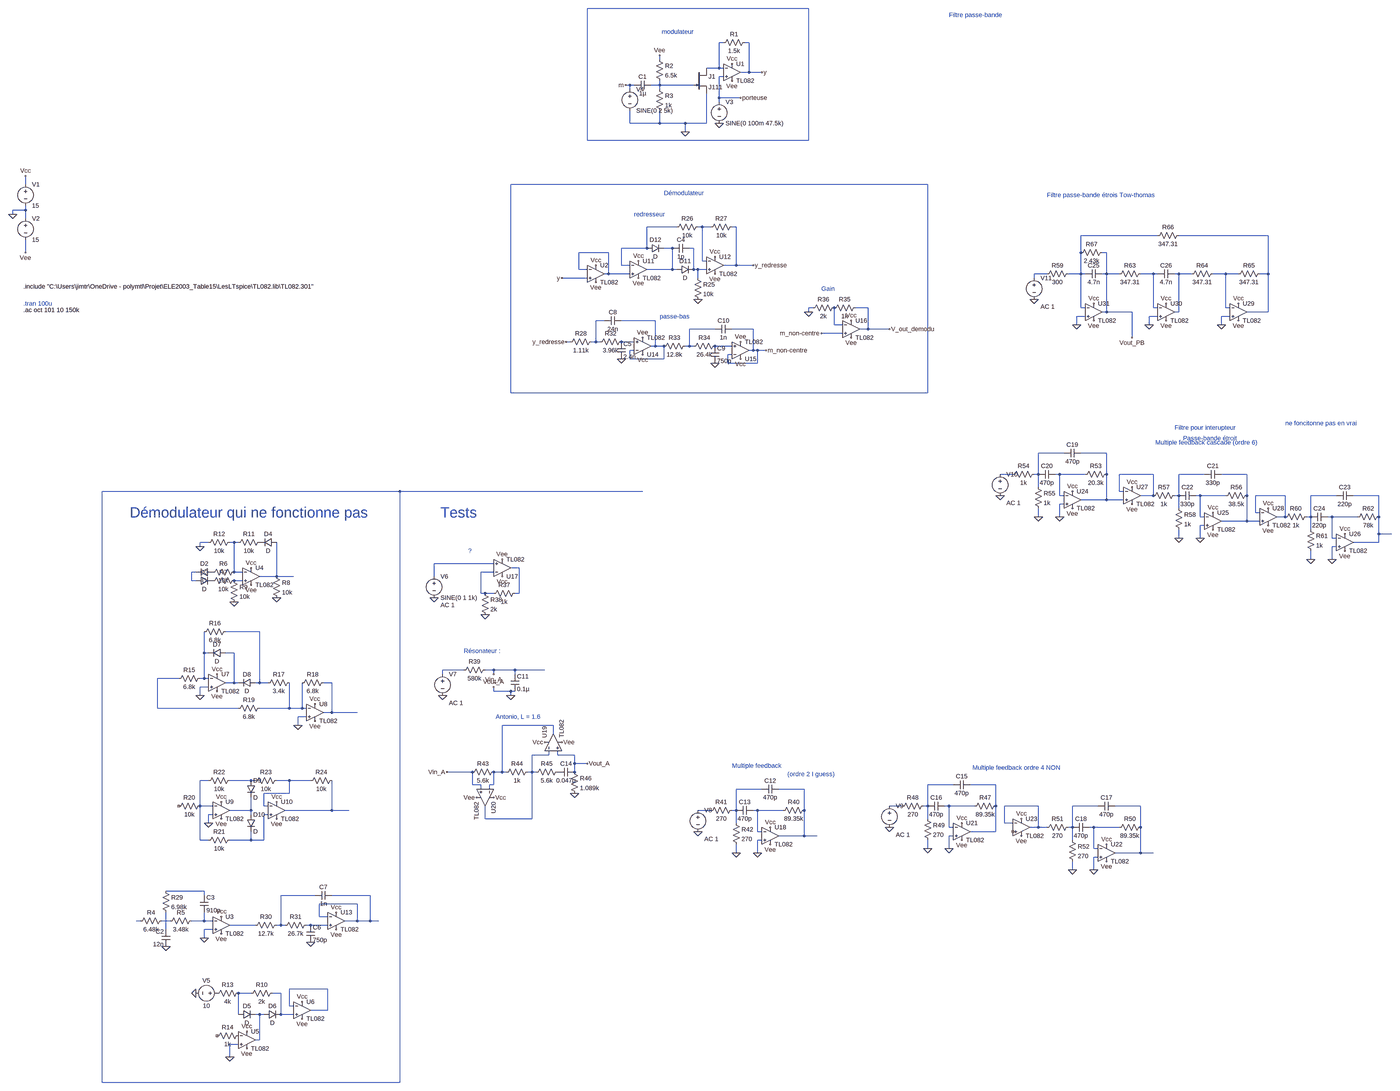
[diagram p0: schematic MonCircuit.asc, whole sheet]
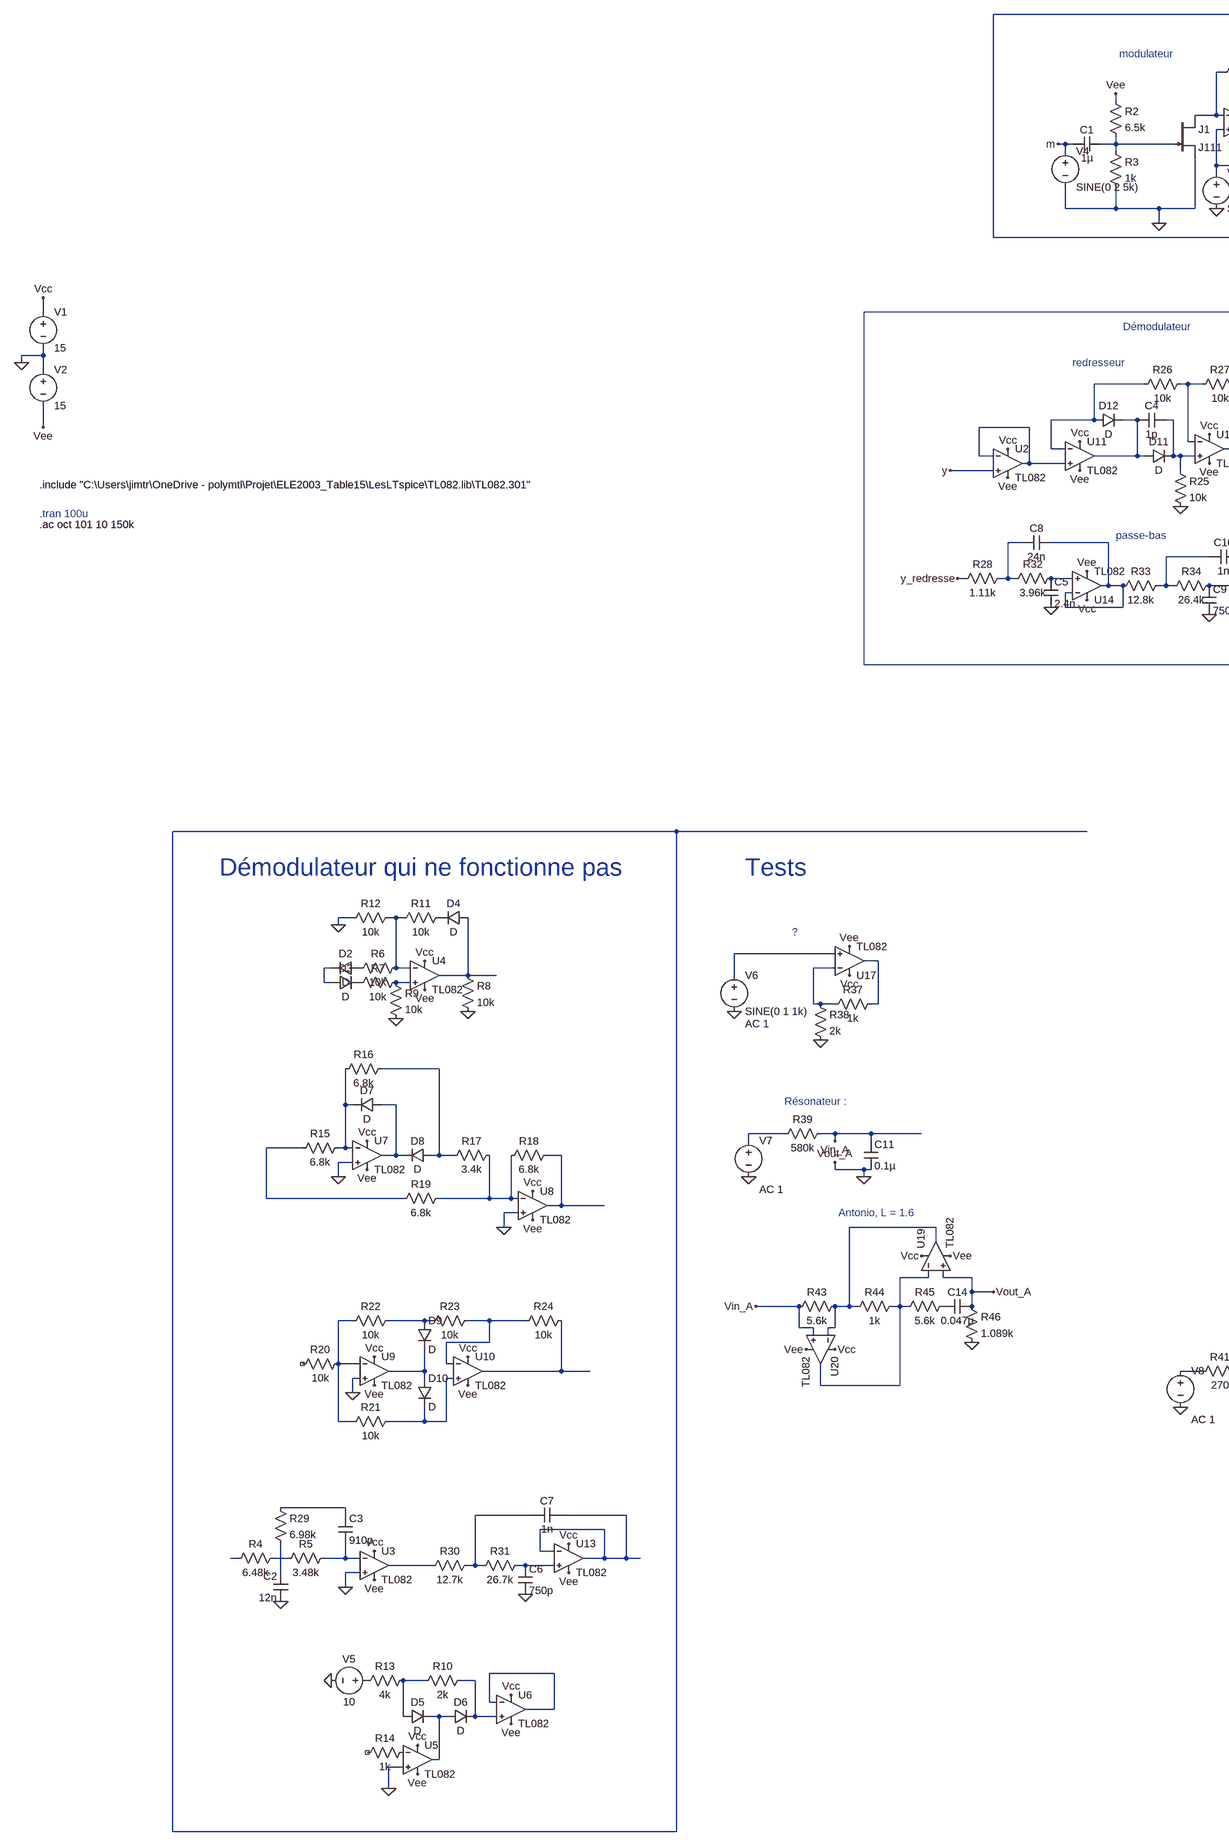
[diagram p1: schematic MonCircuit.asc, part, row 1 of 1, column 1 of 2]
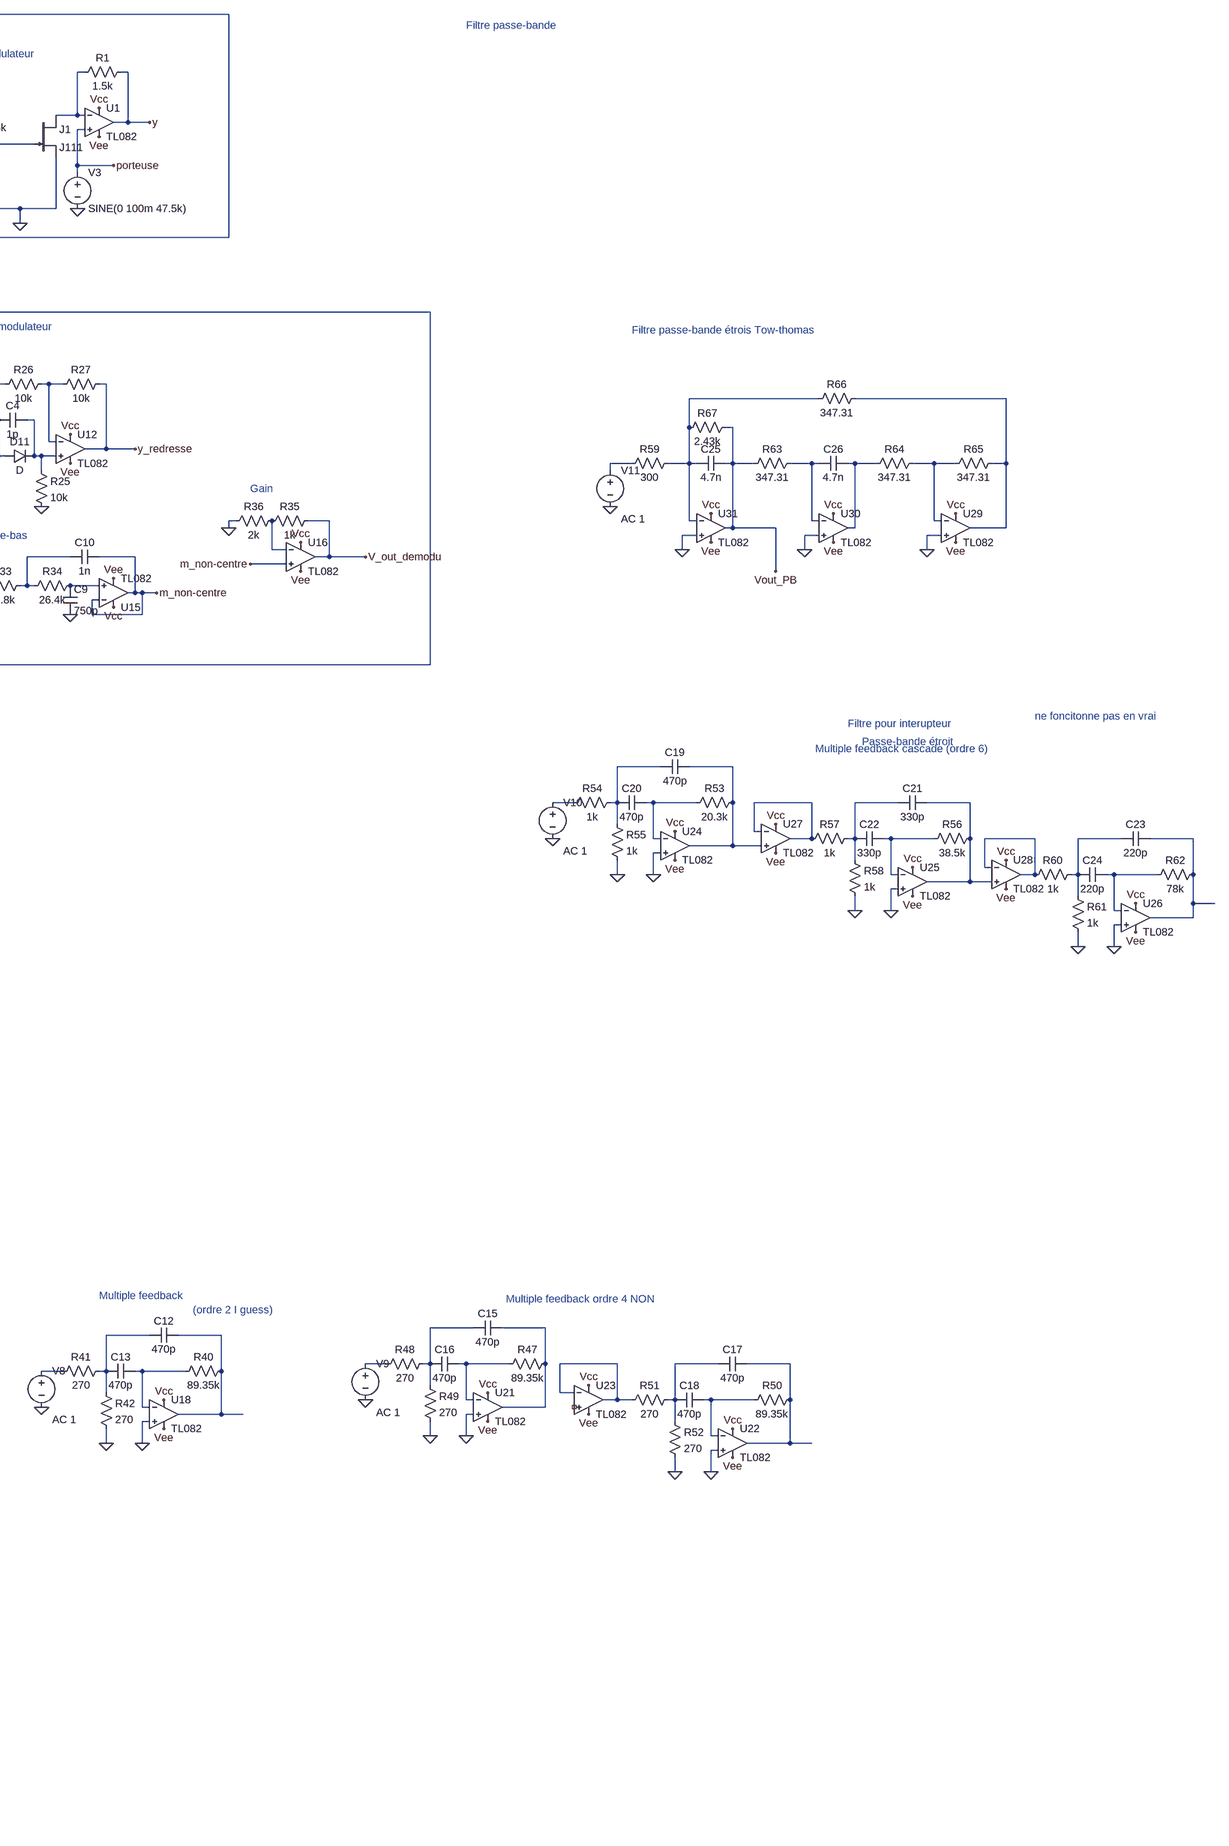
[diagram p2: schematic MonCircuit.asc, part, row 1 of 1, column 2 of 2]
MonCircuit.asc, the LTspice schematic file:
Version 4.1
SHEET 1 3508 3400
WIRE 1248 -880 416 -880
WIRE 928 -752 912 -752
WIRE 1024 -752 1008 -752
WIRE 688 -688 688 -704
WIRE 912 -656 912 -752
WIRE 912 -656 864 -656
WIRE 928 -656 912 -656
WIRE 1024 -640 1024 -752
WIRE 1024 -640 992 -640
WIRE 1072 -640 1024 -640
WIRE 928 -624 912 -624
WIRE 576 -592 560 -592
WIRE 592 -592 576 -592
WIRE 688 -592 688 -608
WIRE 688 -592 656 -592
WIRE 816 -592 688 -592
WIRE 576 -576 576 -592
WIRE 688 -576 688 -592
WIRE 912 -544 912 -624
WIRE 992 -544 912 -544
WIRE 912 -528 912 -544
WIRE 576 -448 576 -496
WIRE 688 -448 688 -496
WIRE 688 -448 576 -448
WIRE 784 -448 688 -448
WIRE 864 -448 864 -560
WIRE 864 -448 784 -448
WIRE 784 -416 784 -448
WIRE 416 -384 416 -880
WIRE 1248 -384 1248 -880
WIRE 1248 -384 416 -384
WIRE -1696 -208 -1696 -240
WIRE 1696 -208 128 -208
WIRE -1696 -112 -1696 -128
WIRE -1696 -112 -1744 -112
WIRE -1744 -96 -1744 -112
WIRE -1696 -80 -1696 -112
WIRE 752 -48 640 -48
WIRE 848 -48 832 -48
WIRE 880 -48 848 -48
WIRE 976 -48 960 -48
WIRE 2560 -16 2272 -16
WIRE 2976 -16 2640 -16
WIRE 640 32 640 -48
WIRE 640 32 544 32
WIRE 736 32 704 32
WIRE 816 32 800 32
WIRE -1696 48 -1696 0
WIRE 496 48 384 48
WIRE 2272 48 2272 -16
WIRE 2368 48 2352 48
WIRE 848 80 848 -48
WIRE 864 80 848 80
WIRE 544 96 544 32
WIRE 576 96 544 96
WIRE 976 96 976 -48
WIRE 976 96 928 96
WIRE 1040 96 976 96
WIRE 384 112 384 48
WIRE 416 112 384 112
WIRE 736 112 736 32
WIRE 736 112 640 112
WIRE 752 112 736 112
WIRE 816 112 816 32
WIRE 832 112 816 112
WIRE 864 112 832 112
WIRE 496 128 496 48
WIRE 496 128 480 128
WIRE 576 128 496 128
WIRE 2144 128 2096 128
WIRE 2272 128 2272 48
WIRE 2272 128 2224 128
WIRE 2288 128 2272 128
WIRE 2368 128 2368 48
WIRE 2368 128 2352 128
WIRE 2416 128 2368 128
WIRE 2544 128 2496 128
WIRE 2560 128 2544 128
WIRE 2640 128 2624 128
WIRE 2688 128 2640 128
WIRE 2816 128 2768 128
WIRE 2864 128 2816 128
WIRE 2976 128 2976 -16
WIRE 2976 128 2944 128
WIRE 416 144 320 144
WIRE 832 144 832 112
WIRE 2096 144 2096 128
WIRE 1264 256 1248 256
WIRE 1472 256 1424 256
WIRE 2272 256 2272 128
WIRE 2288 256 2272 256
WIRE 2544 256 2544 128
WIRE 2560 256 2544 256
WIRE 2816 256 2816 128
WIRE 2832 256 2816 256
WIRE 1248 272 1248 256
WIRE 2368 272 2368 128
WIRE 2368 272 2352 272
WIRE 2464 272 2368 272
WIRE 2640 272 2640 128
WIRE 2640 272 2624 272
WIRE 2976 272 2976 128
WIRE 2976 272 2896 272
WIRE 2288 288 2256 288
WIRE 2560 288 2528 288
WIRE 2832 288 2800 288
WIRE 480 304 448 304
WIRE 672 304 544 304
WIRE 1344 320 1344 256
WIRE 1376 320 1344 320
WIRE 2256 320 2256 288
WIRE 2528 320 2528 288
WIRE 2800 320 2800 288
WIRE 896 336 800 336
WIRE 1040 336 960 336
WIRE 1472 336 1472 256
WIRE 1472 336 1440 336
WIRE 1552 336 1472 336
WIRE 1376 352 1296 352
WIRE 2464 368 2464 272
WIRE 352 384 336 384
WIRE 448 384 448 304
WIRE 448 384 432 384
WIRE 464 384 448 384
WIRE 592 384 544 384
WIRE 672 400 672 304
WIRE 672 400 656 400
WIRE 704 400 672 400
WIRE 800 400 800 336
WIRE 800 400 784 400
WIRE 816 400 800 400
WIRE 960 400 896 400
WIRE 592 416 576 416
WIRE 1040 416 1040 336
WIRE 1040 416 1024 416
WIRE 1056 416 1040 416
WIRE 1088 416 1056 416
WIRE 960 432 944 432
WIRE 576 448 576 416
WIRE 704 448 704 400
WIRE 704 448 576 448
WIRE 944 464 944 432
WIRE 1056 464 1056 416
WIRE 1056 464 944 464
WIRE 128 576 128 -208
WIRE 1696 576 1696 -208
WIRE 1696 576 128 576
WIRE 2208 1024 2112 1024
WIRE 2368 1024 2272 1024
WIRE 2016 1104 1968 1104
WIRE 2112 1104 2112 1024
WIRE 2112 1104 2096 1104
WIRE 2192 1104 2176 1104
WIRE 2288 1104 2192 1104
WIRE 2368 1104 2368 1024
WIRE 2544 1104 2416 1104
WIRE 2736 1104 2640 1104
WIRE 2896 1104 2800 1104
WIRE 2112 1152 2112 1104
WIRE -288 1168 -1408 1168
WIRE 624 1168 -288 1168
WIRE 2416 1168 2416 1104
WIRE 2432 1168 2416 1168
WIRE 2192 1184 2192 1104
WIRE 2208 1184 2192 1184
WIRE 2544 1184 2544 1104
WIRE 2544 1184 2496 1184
WIRE 2640 1184 2640 1104
WIRE 2640 1184 2624 1184
WIRE 2720 1184 2704 1184
WIRE 2816 1184 2720 1184
WIRE 2896 1184 2896 1104
WIRE 3040 1184 2928 1184
WIRE 3232 1184 3136 1184
WIRE 3392 1184 3296 1184
WIRE 2368 1200 2368 1104
WIRE 2368 1200 2272 1200
WIRE 2432 1200 2368 1200
WIRE 2208 1216 2192 1216
WIRE 2640 1232 2640 1184
WIRE 2928 1248 2928 1184
WIRE 2944 1248 2928 1248
WIRE 2112 1264 2112 1232
WIRE 2192 1264 2192 1216
WIRE 2720 1264 2720 1184
WIRE 2736 1264 2720 1264
WIRE 3040 1264 3040 1184
WIRE 3040 1264 3008 1264
WIRE 3136 1264 3136 1184
WIRE 3136 1264 3120 1264
WIRE 3216 1264 3200 1264
WIRE 3312 1264 3216 1264
WIRE 3392 1264 3392 1184
WIRE 2896 1280 2896 1184
WIRE 2896 1280 2800 1280
WIRE 2944 1280 2896 1280
WIRE 2736 1296 2720 1296
WIRE 3136 1312 3136 1264
WIRE 3392 1328 3392 1264
WIRE 3440 1328 3392 1328
WIRE 2640 1344 2640 1312
WIRE 2720 1344 2720 1296
WIRE 3216 1344 3216 1264
WIRE 3232 1344 3216 1344
WIRE -1008 1360 -1040 1360
WIRE -912 1360 -928 1360
WIRE -896 1360 -912 1360
WIRE 3392 1360 3392 1328
WIRE 3392 1360 3296 1360
WIRE -1040 1376 -1040 1360
WIRE 3232 1376 3216 1376
WIRE 3136 1424 3136 1392
WIRE 3216 1424 3216 1376
WIRE 64 1440 -160 1440
WIRE 160 1456 128 1456
WIRE -1056 1472 -1072 1472
WIRE -912 1472 -912 1360
WIRE -880 1472 -912 1472
WIRE 64 1472 16 1472
WIRE -752 1488 -752 1360
WIRE -752 1488 -816 1488
WIRE -688 1488 -752 1488
WIRE -160 1488 -160 1440
WIRE -1072 1504 -1072 1472
WIRE -1056 1504 -1072 1504
WIRE -880 1504 -912 1504
WIRE 16 1552 16 1472
WIRE 32 1552 16 1552
WIRE 64 1552 32 1552
WIRE 160 1552 160 1456
WIRE 160 1552 144 1552
WIRE -816 1696 -944 1696
WIRE -1024 1776 -1024 1696
WIRE -1008 1776 -1024 1776
WIRE -912 1776 -944 1776
WIRE -48 1840 -128 1840
WIRE 64 1840 32 1840
WIRE 144 1840 64 1840
WIRE 256 1840 144 1840
WIRE -128 1856 -128 1840
WIRE 64 1856 64 1840
WIRE 144 1856 144 1840
WIRE -1120 1872 -1200 1872
WIRE -1024 1872 -1024 1776
WIRE -1024 1872 -1040 1872
WIRE -1008 1872 -1024 1872
WIRE -912 1888 -912 1776
WIRE -912 1888 -944 1888
WIRE -896 1888 -912 1888
WIRE -816 1888 -816 1696
WIRE -816 1888 -832 1888
WIRE -784 1888 -816 1888
WIRE -544 1888 -576 1888
WIRE -1008 1904 -1040 1904
WIRE 64 1920 64 1904
WIRE 128 1920 64 1920
WIRE 144 1920 128 1920
WIRE -1040 1936 -1040 1904
WIRE 128 1936 128 1920
WIRE -1200 1984 -1200 1872
WIRE -896 1984 -1200 1984
WIRE -704 1984 -704 1888
WIRE -704 1984 -816 1984
WIRE -656 1984 -656 1888
WIRE -656 1984 -704 1984
WIRE -640 1984 -656 1984
WIRE -544 2000 -544 1888
WIRE -544 2000 -576 2000
WIRE -448 2000 -544 2000
WIRE -640 2016 -672 2016
WIRE -672 2048 -672 2016
WIRE 288 2048 96 2048
WIRE 288 2080 288 2048
WIRE 272 2160 272 2144
WIRE 272 2160 208 2160
WIRE 304 2160 304 2144
WIRE 368 2160 304 2160
WIRE 368 2192 368 2160
WIRE 416 2192 368 2192
WIRE -16 2224 -112 2224
WIRE 96 2224 96 2048
WIRE 96 2224 64 2224
WIRE 112 2224 96 2224
WIRE 208 2224 208 2160
WIRE 208 2224 192 2224
WIRE 224 2224 208 2224
WIRE 368 2224 368 2192
WIRE -1008 2256 -1040 2256
WIRE -848 2256 -928 2256
WIRE -832 2256 -848 2256
WIRE -704 2256 -752 2256
WIRE -624 2256 -704 2256
WIRE -16 2272 -16 2224
WIRE 16 2272 -16 2272
WIRE 64 2272 64 2224
WIRE 64 2272 48 2272
WIRE 1792 2272 1696 2272
WIRE 1952 2272 1856 2272
WIRE 16 2288 16 2272
WIRE 48 2288 48 2272
WIRE 1072 2288 976 2288
WIRE 1232 2288 1136 2288
WIRE -704 2304 -704 2256
WIRE -704 2304 -800 2304
WIRE -1040 2352 -1040 2256
WIRE -992 2352 -1040 2352
WIRE -800 2352 -800 2304
WIRE -784 2352 -800 2352
WIRE 1600 2352 1552 2352
WIRE 1696 2352 1696 2272
WIRE 1696 2352 1680 2352
WIRE 1776 2352 1760 2352
WIRE 1872 2352 1776 2352
WIRE 1952 2352 1952 2272
WIRE 2112 2352 1984 2352
WIRE 2336 2352 2240 2352
WIRE 2496 2352 2400 2352
WIRE -848 2368 -848 2320
WIRE -848 2368 -928 2368
WIRE -544 2368 -544 2256
WIRE -544 2368 -720 2368
WIRE -480 2368 -544 2368
WIRE 880 2368 832 2368
WIRE 976 2368 976 2288
WIRE 976 2368 960 2368
WIRE 1056 2368 1040 2368
WIRE 1152 2368 1056 2368
WIRE 1232 2368 1232 2288
WIRE -992 2384 -1008 2384
WIRE -848 2384 -848 2368
WIRE -784 2384 -800 2384
WIRE 32 2400 32 2352
WIRE 208 2400 208 2224
WIRE 208 2400 32 2400
WIRE 1696 2400 1696 2352
WIRE -1008 2416 -1008 2384
WIRE 976 2416 976 2368
WIRE 1984 2416 1984 2352
WIRE 2016 2416 1984 2416
WIRE 1776 2432 1776 2352
WIRE 1792 2432 1776 2432
WIRE 2112 2432 2112 2352
WIRE 2112 2432 2080 2432
WIRE 2144 2432 2112 2432
WIRE 2240 2432 2240 2352
WIRE 2240 2432 2224 2432
WIRE 2320 2432 2304 2432
WIRE 2416 2432 2320 2432
WIRE 2496 2432 2496 2352
WIRE 1056 2448 1056 2368
WIRE 1072 2448 1056 2448
WIRE 1952 2448 1952 2352
WIRE 1952 2448 1856 2448
WIRE 1232 2464 1232 2368
WIRE 1232 2464 1136 2464
WIRE 1280 2464 1232 2464
WIRE 1792 2464 1776 2464
WIRE -1040 2480 -1040 2352
WIRE -1008 2480 -1040 2480
WIRE -848 2480 -848 2448
WIRE -848 2480 -928 2480
WIRE -800 2480 -800 2384
WIRE -800 2480 -848 2480
WIRE 1072 2480 1056 2480
WIRE 2240 2480 2240 2432
WIRE 1696 2512 1696 2480
WIRE 1776 2512 1776 2464
WIRE 2320 2512 2320 2432
WIRE 2336 2512 2320 2512
WIRE 976 2528 976 2496
WIRE 1056 2528 1056 2480
WIRE 2496 2528 2496 2432
WIRE 2496 2528 2400 2528
WIRE 2544 2528 2496 2528
WIRE 2336 2544 2320 2544
WIRE 2240 2592 2240 2560
WIRE 2320 2592 2320 2544
WIRE -1024 2672 -1168 2672
WIRE -1024 2688 -1024 2672
WIRE -608 2688 -736 2688
WIRE -400 2688 -544 2688
WIRE -448 2720 -592 2720
WIRE -592 2768 -592 2720
WIRE -560 2768 -592 2768
WIRE -1264 2784 -1280 2784
WIRE -1152 2784 -1184 2784
WIRE -1024 2784 -1024 2752
WIRE -1024 2784 -1072 2784
WIRE -992 2784 -1024 2784
WIRE -448 2784 -448 2720
WIRE -448 2784 -496 2784
WIRE -400 2784 -400 2688
WIRE -400 2784 -448 2784
WIRE -368 2784 -400 2784
WIRE -832 2800 -928 2800
WIRE -736 2800 -736 2688
WIRE -736 2800 -752 2800
WIRE -720 2800 -736 2800
WIRE -624 2800 -640 2800
WIRE -560 2800 -624 2800
WIRE -1168 2816 -1168 2752
WIRE -992 2816 -1024 2816
WIRE -1024 2848 -1024 2816
WIRE -560 3040 -704 3040
WIRE -848 3056 -896 3056
WIRE -736 3056 -768 3056
WIRE -704 3104 -704 3040
WIRE -688 3104 -704 3104
WIRE -560 3120 -560 3040
WIRE -560 3120 -624 3120
WIRE -896 3136 -896 3056
WIRE -816 3136 -832 3136
WIRE -800 3136 -816 3136
WIRE -736 3136 -736 3056
WIRE -688 3136 -736 3136
WIRE -816 3232 -816 3136
WIRE -816 3232 -832 3232
WIRE -896 3248 -928 3248
WIRE -928 3296 -928 3248
WIRE -1408 3392 -1408 1168
WIRE -288 3392 -288 1168
WIRE -288 3392 -1408 3392
FLAG -1744 -96 0
FLAG -1696 48 Vee
FLAG -1696 -240 Vcc
FLAG 960 -608 Vee
FLAG 960 -672 Vcc
FLAG 1072 -640 y
FLAG 912 -448 0
FLAG 992 -544 porteuse
FLAG 784 -416 0
FLAG 688 -704 Vee
FLAG 560 -592 m
FLAG 448 160 Vee
FLAG 448 96 Vcc
FLAG 320 144 y
FLAG -848 1520 Vee
FLAG -848 1456 Vcc
FLAG -752 1568 0
FLAG -1040 1376 0
FLAG -912 1584 0
FLAG -864 3200 Vcc
FLAG -864 3264 Vee
FLAG -928 3296 0
FLAG -1056 3056 0
FLAG -656 3088 Vcc
FLAG -656 3152 Vee
FLAG -976 1920 Vee
FLAG -976 1856 Vcc
FLAG -1040 1936 0
FLAG -672 2048 0
FLAG -608 2032 Vee
FLAG -608 1968 Vcc
FLAG -960 2336 Vcc
FLAG -752 2336 Vcc
FLAG -960 2400 Vee
FLAG -752 2400 Vee
FLAG -1008 2416 0
FLAG 608 144 Vee
FLAG 608 80 Vcc
FLAG 896 128 Vee
FLAG 896 64 Vcc
FLAG 832 224 0
FLAG 1040 96 y_redresse
FLAG -960 2832 Vee
FLAG -960 2768 Vcc
FLAG -1024 2848 0
FLAG -1168 2880 0
FLAG -624 2864 0
FLAG -528 2816 Vee
FLAG -528 2752 Vcc
FLAG 544 448 0
FLAG 624 368 Vee
FLAG 624 432 Vcc
FLAG 896 464 0
FLAG 992 384 Vee
FLAG 992 448 Vcc
FLAG 336 384 y_redresse
FLAG 1088 416 m_non-centre
FLAG 1296 352 m_non-centre
FLAG 1408 304 Vcc
FLAG 1408 368 Vee
FLAG 1248 272 0
FLAG 96 1488 Vcc
FLAG 96 1424 Vee
FLAG -160 1568 0
FLAG 32 1632 0
FLAG -128 1936 0
FLAG 128 1936 0
FLAG 1552 336 V_out_demodu
FLAG 1104 2432 Vcc
FLAG 1104 2496 Vee
FLAG 1056 2528 0
FLAG 832 2448 0
FLAG 976 2528 0
FLAG 256 2112 Vcc
FLAG 64 2320 Vcc
FLAG 0 2320 Vee
FLAG 320 2112 Vee
FLAG 368 2304 0
FLAG -112 2224 Vin_A
FLAG 416 2192 Vout_A
FLAG 64 1856 Vin_A
FLAG 64 1904 Vout_A
FLAG 1824 2416 Vcc
FLAG 1824 2480 Vee
FLAG 1776 2512 0
FLAG 1552 2432 0
FLAG 1696 2512 0
FLAG 2368 2496 Vcc
FLAG 2368 2560 Vee
FLAG 2320 2592 0
FLAG 2240 2592 0
FLAG 2048 2400 Vcc
FLAG 2048 2464 Vee
FLAG 2240 1168 Vcc
FLAG 2240 1232 Vee
FLAG 2192 1264 0
FLAG 1968 1184 0
FLAG 2112 1264 0
FLAG 2768 1248 Vcc
FLAG 2768 1312 Vee
FLAG 2720 1344 0
FLAG 2640 1344 0
FLAG 3264 1328 Vcc
FLAG 3264 1392 Vee
FLAG 3216 1424 0
FLAG 3136 1424 0
FLAG 2464 1216 Vee
FLAG 2464 1152 Vcc
FLAG 2976 1296 Vee
FLAG 2976 1232 Vcc
FLAG 2320 240 Vcc
FLAG 2592 240 Vcc
FLAG 2864 240 Vcc
FLAG 2320 304 Vee
FLAG 2592 304 Vee
FLAG 2864 304 Vee
FLAG 2256 320 0
FLAG 2528 320 0
FLAG 2800 320 0
FLAG 2096 224 0
FLAG 2464 368 Vout_PB
SYMBOL voltage -1696 -224 R0
WINDOW 123 0 0 Left 0
WINDOW 39 0 0 Left 0
SYMATTR InstName V1
SYMATTR Value 15
SYMBOL voltage -1696 -96 R0
WINDOW 123 0 0 Left 0
WINDOW 39 0 0 Left 0
SYMATTR InstName V2
SYMATTR Value 15
SYMBOL OpAmps\\opamp2 960 -704 R0
SYMATTR InstName U1
SYMATTR Value TL082
SYMBOL res 1024 -768 R90
WINDOW 0 0 56 VBottom 2
WINDOW 3 32 56 VTop 2
SYMATTR InstName R1
SYMATTR Value 1.5k
SYMBOL res 672 -704 R0
SYMATTR InstName R2
SYMATTR Value 6.5k
SYMBOL res 672 -592 R0
SYMATTR InstName R3
SYMATTR Value 1k
SYMBOL njf 816 -656 R0
SYMATTR InstName J1
SYMATTR Value J111
SYMBOL voltage 912 -544 R0
WINDOW 123 0 0 Left 0
WINDOW 39 0 0 Left 0
SYMATTR InstName V3
SYMATTR Value SINE(0 100m 47.5k)
SYMBOL cap 656 -608 R90
WINDOW 0 0 32 VBottom 2
WINDOW 3 32 32 VTop 2
SYMATTR InstName C1
SYMATTR Value 1µ
SYMBOL voltage 576 -592 R0
WINDOW 123 0 0 Left 0
WINDOW 39 0 0 Left 0
SYMATTR InstName V4
SYMATTR Value SINE(0 2 5k)
SYMBOL OpAmps\\opamp2 448 64 R0
SYMATTR InstName U2
SYMATTR Value TL082
SYMBOL OpAmps\\opamp2 -848 1424 R0
SYMATTR InstName U4
SYMATTR Value TL082
SYMBOL diode -992 1456 R90
WINDOW 0 0 32 VBottom 2
WINDOW 3 32 32 VTop 2
SYMATTR InstName D2
SYMBOL diode -1056 1520 R270
WINDOW 0 32 32 VTop 2
WINDOW 3 0 32 VBottom 2
SYMATTR InstName D3
SYMBOL res -768 1472 R0
SYMATTR InstName R8
SYMATTR Value 10k
SYMBOL res -928 1488 R0
SYMATTR InstName R9
SYMATTR Value 10k
SYMBOL res -912 1344 R90
WINDOW 0 0 56 VBottom 2
WINDOW 3 32 56 VTop 2
SYMATTR InstName R12
SYMATTR Value 10k
SYMBOL res -800 1344 R90
WINDOW 0 0 56 VBottom 2
WINDOW 3 32 56 VTop 2
SYMATTR InstName R11
SYMATTR Value 10k
SYMBOL diode -752 1344 R90
WINDOW 0 0 32 VBottom 2
WINDOW 3 32 32 VTop 2
SYMATTR InstName D4
SYMBOL res -896 1456 R90
WINDOW 0 0 56 VBottom 2
WINDOW 3 32 56 VTop 2
SYMATTR InstName R6
SYMATTR Value 10k
SYMBOL res -896 1488 R90
WINDOW 0 0 56 VBottom 2
WINDOW 3 32 56 VTop 2
SYMATTR InstName R7
SYMATTR Value 10k
SYMBOL OpAmps\\opamp2 -864 3168 R0
SYMATTR InstName U5
SYMATTR Value TL082
SYMBOL diode -896 3152 R270
WINDOW 0 32 32 VTop 2
WINDOW 3 0 32 VBottom 2
SYMATTR InstName D5
SYMBOL diode -800 3152 R270
WINDOW 0 32 32 VTop 2
WINDOW 3 0 32 VBottom 2
SYMATTR InstName D6
SYMBOL res -752 3040 R90
WINDOW 0 0 56 VBottom 2
WINDOW 3 32 56 VTop 2
SYMATTR InstName R10
SYMATTR Value 2k
SYMBOL res -880 3040 R90
WINDOW 0 0 56 VBottom 2
WINDOW 3 32 56 VTop 2
SYMATTR InstName R13
SYMATTR Value 4k
SYMBOL res -880 3200 R90
WINDOW 0 0 56 VBottom 2
WINDOW 3 32 56 VTop 2
SYMATTR InstName R14
SYMATTR Value 1k
SYMBOL voltage -960 3056 R90
WINDOW 0 -32 56 VBottom 2
WINDOW 3 32 56 VTop 2
WINDOW 123 0 0 Left 0
WINDOW 39 0 0 Left 0
SYMATTR InstName V5
SYMATTR Value 10
SYMBOL OpAmps\\opamp2 -656 3056 R0
SYMATTR InstName U6
SYMATTR Value TL082
SYMBOL res -1024 1856 R90
WINDOW 0 0 56 VBottom 2
WINDOW 3 32 56 VTop 2
SYMATTR InstName R15
SYMATTR Value 6.8k
SYMBOL OpAmps\\opamp2 -976 1824 R0
SYMATTR InstName U7
SYMATTR Value TL082
SYMBOL diode -944 1760 R90
WINDOW 0 0 32 VBottom 2
WINDOW 3 32 32 VTop 2
SYMATTR InstName D7
SYMBOL res -928 1680 R90
WINDOW 0 0 56 VBottom 2
WINDOW 3 32 56 VTop 2
SYMATTR InstName R16
SYMATTR Value 6.8k
SYMBOL diode -832 1872 R90
WINDOW 0 0 32 VBottom 2
WINDOW 3 32 32 VTop 2
SYMATTR InstName D8
SYMBOL res -688 1872 R90
WINDOW 0 0 56 VBottom 2
WINDOW 3 32 56 VTop 2
SYMATTR InstName R17
SYMATTR Value 3.4k
SYMBOL OpAmps\\opamp2 -608 1936 R0
SYMATTR InstName U8
SYMATTR Value TL082
SYMBOL res -560 1872 R90
WINDOW 0 0 56 VBottom 2
WINDOW 3 32 56 VTop 2
SYMATTR InstName R18
SYMATTR Value 6.8k
SYMBOL res -800 1968 R90
WINDOW 0 0 56 VBottom 2
WINDOW 3 32 56 VTop 2
SYMATTR InstName R19
SYMATTR Value 6.8k
SYMBOL OpAmps\\opamp2 -960 2304 R0
SYMATTR InstName U9
SYMATTR Value TL082
SYMBOL OpAmps\\opamp2 -752 2304 R0
SYMATTR InstName U10
SYMATTR Value TL082
SYMBOL res -1024 2336 R90
WINDOW 0 0 56 VBottom 2
WINDOW 3 32 56 VTop 2
SYMATTR InstName R20
SYMATTR Value 10k
SYMBOL res -912 2464 R90
WINDOW 0 0 56 VBottom 2
WINDOW 3 32 56 VTop 2
SYMATTR InstName R21
SYMATTR Value 10k
SYMBOL res -912 2240 R90
WINDOW 0 0 56 VBottom 2
WINDOW 3 32 56 VTop 2
SYMATTR InstName R22
SYMATTR Value 10k
SYMBOL res -736 2240 R90
WINDOW 0 0 56 VBottom 2
WINDOW 3 32 56 VTop 2
SYMATTR InstName R23
SYMATTR Value 10k
SYMBOL res -528 2240 R90
WINDOW 0 0 56 VBottom 2
WINDOW 3 32 56 VTop 2
SYMATTR InstName R24
SYMATTR Value 10k
SYMBOL diode -864 2256 R0
SYMATTR InstName D9
SYMBOL diode -864 2384 R0
SYMATTR InstName D10
SYMBOL OpAmps\\opamp2 608 48 R0
SYMATTR InstName U11
SYMATTR Value TL082
SYMBOL diode 752 128 R270
WINDOW 0 32 32 VTop 2
WINDOW 3 0 32 VBottom 2
SYMATTR InstName D11
SYMBOL cap 800 16 R90
WINDOW 0 0 32 VBottom 2
WINDOW 3 32 32 VTop 2
SYMATTR InstName C4
SYMATTR Value 1p
SYMBOL diode 640 48 R270
WINDOW 0 32 32 VTop 2
WINDOW 3 0 32 VBottom 2
SYMATTR InstName D12
SYMBOL OpAmps\\opamp2 896 32 R0
SYMATTR InstName U12
SYMATTR Value TL082
SYMBOL res 816 128 R0
SYMATTR InstName R25
SYMATTR Value 10k
SYMBOL res 848 -64 R90
WINDOW 0 0 56 VBottom 2
WINDOW 3 32 56 VTop 2
SYMATTR InstName R26
SYMATTR Value 10k
SYMBOL res 976 -64 R90
WINDOW 0 0 56 VBottom 2
WINDOW 3 32 56 VTop 2
SYMATTR InstName R27
SYMATTR Value 10k
SYMBOL res -1168 2768 R90
WINDOW 0 0 56 VBottom 2
WINDOW 3 32 56 VTop 2
SYMATTR InstName R4
SYMATTR Value 6.48k
SYMBOL res -1056 2768 R90
WINDOW 0 0 56 VBottom 2
WINDOW 3 32 56 VTop 2
SYMATTR InstName R5
SYMATTR Value 3.48k
SYMBOL cap -1152 2880 R180
WINDOW 0 24 56 Left 2
WINDOW 3 24 8 Left 2
SYMATTR InstName C2
SYMATTR Value 12n
SYMBOL res -1184 2656 R0
SYMATTR InstName R29
SYMATTR Value 6.98k
SYMBOL cap -1040 2688 R0
SYMATTR InstName C3
SYMATTR Value 910p
SYMBOL OpAmps\\opamp2 -960 2736 R0
SYMATTR InstName U3
SYMATTR Value TL082
SYMBOL res -736 2784 R90
WINDOW 0 0 56 VBottom 2
WINDOW 3 32 56 VTop 2
SYMATTR InstName R30
SYMATTR Value 12.7k
SYMBOL res -624 2784 R90
WINDOW 0 0 56 VBottom 2
WINDOW 3 32 56 VTop 2
SYMATTR InstName R31
SYMATTR Value 26.7k
SYMBOL cap -640 2800 R0
SYMATTR InstName C6
SYMATTR Value 750p
SYMBOL OpAmps\\opamp2 -528 2720 R0
SYMATTR InstName U13
SYMATTR Value TL082
SYMBOL cap -544 2672 R90
WINDOW 0 0 32 VBottom 2
WINDOW 3 32 32 VTop 2
SYMATTR InstName C7
SYMATTR Value 1n
SYMBOL res 448 368 R90
WINDOW 0 0 56 VBottom 2
WINDOW 3 32 56 VTop 2
SYMATTR InstName R28
SYMATTR Value 1.11k
SYMBOL res 560 368 R90
WINDOW 0 0 56 VBottom 2
WINDOW 3 32 56 VTop 2
SYMATTR InstName R32
SYMATTR Value 3.96k
SYMBOL cap 528 384 R0
SYMATTR InstName C5
SYMATTR Value 2.4n
SYMBOL cap 544 288 R90
WINDOW 0 0 32 VBottom 2
WINDOW 3 32 32 VTop 2
SYMATTR InstName C8
SYMATTR Value 24n
SYMBOL OpAmps\\opamp2 624 464 M180
SYMATTR InstName U14
SYMATTR Value TL082
SYMBOL res 800 384 R90
WINDOW 0 0 56 VBottom 2
WINDOW 3 32 56 VTop 2
SYMATTR InstName R33
SYMATTR Value 12.8k
SYMBOL res 912 384 R90
WINDOW 0 0 56 VBottom 2
WINDOW 3 32 56 VTop 2
SYMATTR InstName R34
SYMATTR Value 26.4k
SYMBOL cap 880 400 R0
SYMATTR InstName C9
SYMATTR Value 750p
SYMBOL OpAmps\\opamp2 992 480 M180
SYMATTR InstName U15
SYMATTR Value TL082
SYMBOL cap 960 320 R90
WINDOW 0 0 32 VBottom 2
WINDOW 3 32 32 VTop 2
SYMATTR InstName C10
SYMATTR Value 1n
SYMBOL OpAmps\\opamp2 1408 272 R0
SYMATTR InstName U16
SYMATTR Value TL082
SYMBOL res 1440 240 R90
WINDOW 0 0 56 VBottom 2
WINDOW 3 32 56 VTop 2
SYMATTR InstName R35
SYMATTR Value 1k
SYMBOL res 1360 240 R90
WINDOW 0 0 56 VBottom 2
WINDOW 3 32 56 VTop 2
SYMATTR InstName R36
SYMATTR Value 2k
SYMBOL voltage -160 1472 R0
WINDOW 123 24 124 Left 2
WINDOW 39 0 0 Left 0
SYMATTR Value2 AC 1
SYMATTR InstName V6
SYMATTR Value SINE(0 1 1k)
SYMBOL OpAmps\\opamp2 96 1520 M180
SYMATTR InstName U17
SYMATTR Value TL082
SYMBOL res 160 1536 R90
WINDOW 0 0 56 VBottom 2
WINDOW 3 32 56 VTop 2
SYMATTR InstName R37
SYMATTR Value 1k
SYMBOL res 16 1536 R0
SYMATTR InstName R38
SYMATTR Value 2k
SYMBOL voltage -128 1840 R0
WINDOW 123 24 124 Left 2
WINDOW 39 0 0 Left 0
SYMATTR Value2 AC 1
SYMATTR InstName V7
SYMATTR Value ""
SYMBOL cap 128 1856 R0
SYMATTR InstName C11
SYMATTR Value 0.1µ
SYMBOL res 48 1824 R90
WINDOW 0 0 56 VBottom 2
WINDOW 3 32 56 VTop 2
SYMATTR InstName R39
SYMATTR Value 580k
SYMBOL OpAmps\\opamp2 1104 2400 R0
SYMATTR InstName U18
SYMATTR Value TL082
SYMBOL cap 1136 2272 R90
WINDOW 0 0 32 VBottom 2
WINDOW 3 32 32 VTop 2
SYMATTR InstName C12
SYMATTR Value 470p
SYMBOL cap 1040 2352 R90
WINDOW 0 0 32 VBottom 2
WINDOW 3 32 32 VTop 2
SYMATTR InstName C13
SYMATTR Value 470p
SYMBOL res 1248 2352 R90
WINDOW 0 0 56 VBottom 2
WINDOW 3 32 56 VTop 2
SYMATTR InstName R40
SYMATTR Value 89.35k
SYMBOL res 864 2384 R270
WINDOW 0 32 56 VTop 2
WINDOW 3 0 56 VBottom 2
SYMATTR InstName R41
SYMATTR Value 270
SYMBOL res 960 2400 R0
SYMATTR InstName R42
SYMATTR Value 270
SYMBOL voltage 832 2352 R0
WINDOW 123 24 124 Left 2
WINDOW 39 0 0 Left 0
SYMATTR Value2 AC 1
SYMATTR InstName V8
SYMATTR Value ""
SYMBOL OpAmps\\opamp2 224 2112 R270
SYMATTR InstName U19
SYMATTR Value TL082
SYMBOL OpAmps\\opamp2 96 2320 R90
SYMATTR InstName U20
SYMATTR Value TL082
SYMBOL res 80 2208 R90
WINDOW 0 0 56 VBottom 2
WINDOW 3 32 56 VTop 2
SYMATTR InstName R43
SYMATTR Value 5.6k
SYMBOL res 208 2208 R90
WINDOW 0 0 56 VBottom 2
WINDOW 3 32 56 VTop 2
SYMATTR InstName R44
SYMATTR Value 1k
SYMBOL res 320 2208 R90
WINDOW 0 0 56 VBottom 2
WINDOW 3 32 56 VTop 2
SYMATTR InstName R45
SYMATTR Value 5.6k
SYMBOL cap 368 2208 R90
WINDOW 0 0 32 VBottom 2
WINDOW 3 32 32 VTop 2
SYMATTR InstName C14
SYMATTR Value 0.047µ
SYMBOL res 352 2208 R0
SYMATTR InstName R46
SYMATTR Value 1.089k
SYMBOL OpAmps\\opamp2 1824 2384 R0
SYMATTR InstName U21
SYMATTR Value TL082
SYMBOL cap 1856 2256 R90
WINDOW 0 0 32 VBottom 2
WINDOW 3 32 32 VTop 2
SYMATTR InstName C15
SYMATTR Value 470p
SYMBOL cap 1760 2336 R90
WINDOW 0 0 32 VBottom 2
WINDOW 3 32 32 VTop 2
SYMATTR InstName C16
SYMATTR Value 470p
SYMBOL res 1968 2336 R90
WINDOW 0 0 56 VBottom 2
WINDOW 3 32 56 VTop 2
SYMATTR InstName R47
SYMATTR Value 89.35k
SYMBOL res 1584 2368 R270
WINDOW 0 32 56 VTop 2
WINDOW 3 0 56 VBottom 2
SYMATTR InstName R48
SYMATTR Value 270
SYMBOL res 1680 2384 R0
SYMATTR InstName R49
SYMATTR Value 270
SYMBOL voltage 1552 2336 R0
WINDOW 123 24 124 Left 2
WINDOW 39 0 0 Left 0
SYMATTR Value2 AC 1
SYMATTR InstName V9
SYMATTR Value ""
SYMBOL OpAmps\\opamp2 2368 2464 R0
SYMATTR InstName U22
SYMATTR Value TL082
SYMBOL cap 2400 2336 R90
WINDOW 0 0 32 VBottom 2
WINDOW 3 32 32 VTop 2
SYMATTR InstName C17
SYMATTR Value 470p
SYMBOL cap 2304 2416 R90
WINDOW 0 0 32 VBottom 2
WINDOW 3 32 32 VTop 2
SYMATTR InstName C18
SYMATTR Value 470p
SYMBOL res 2512 2416 R90
WINDOW 0 0 56 VBottom 2
WINDOW 3 32 56 VTop 2
SYMATTR InstName R50
SYMATTR Value 89.35k
SYMBOL res 2128 2448 R270
WINDOW 0 32 56 VTop 2
WINDOW 3 0 56 VBottom 2
SYMATTR InstName R51
SYMATTR Value 270
SYMBOL res 2224 2464 R0
SYMATTR InstName R52
SYMATTR Value 270
SYMBOL OpAmps\\opamp2 2048 2368 R0
SYMATTR InstName U23
SYMATTR Value TL082
SYMBOL OpAmps\\opamp2 2240 1136 R0
SYMATTR InstName U24
SYMATTR Value TL082
SYMBOL cap 2272 1008 R90
WINDOW 0 0 32 VBottom 2
WINDOW 3 32 32 VTop 2
SYMATTR InstName C19
SYMATTR Value 470p
SYMBOL cap 2176 1088 R90
WINDOW 0 0 32 VBottom 2
WINDOW 3 32 32 VTop 2
SYMATTR InstName C20
SYMATTR Value 470p
SYMBOL res 2384 1088 R90
WINDOW 0 0 56 VBottom 2
WINDOW 3 32 56 VTop 2
SYMATTR InstName R53
SYMATTR Value 20.3k
SYMBOL res 2000 1120 R270
WINDOW 0 32 56 VTop 2
WINDOW 3 0 56 VBottom 2
SYMATTR InstName R54
SYMATTR Value 1k
SYMBOL res 2096 1136 R0
SYMATTR InstName R55
SYMATTR Value 1k
SYMBOL voltage 1968 1088 R0
WINDOW 123 24 124 Left 2
WINDOW 39 0 0 Left 0
SYMATTR Value2 AC 1
SYMATTR InstName V10
SYMATTR Value ""
SYMBOL OpAmps\\opamp2 2768 1216 R0
SYMATTR InstName U25
SYMATTR Value TL082
SYMBOL cap 2800 1088 R90
WINDOW 0 0 32 VBottom 2
WINDOW 3 32 32 VTop 2
SYMATTR InstName C21
SYMATTR Value 330p
SYMBOL cap 2704 1168 R90
WINDOW 0 0 32 VBottom 2
WINDOW 3 32 32 VTop 2
SYMATTR InstName C22
SYMATTR Value 330p
SYMBOL res 2912 1168 R90
WINDOW 0 0 56 VBottom 2
WINDOW 3 32 56 VTop 2
SYMATTR InstName R56
SYMATTR Value 38.5k
SYMBOL res 2528 1200 R270
WINDOW 0 32 56 VTop 2
WINDOW 3 0 56 VBottom 2
SYMATTR InstName R57
SYMATTR Value 1k
SYMBOL res 2624 1216 R0
SYMATTR InstName R58
SYMATTR Value 1k
SYMBOL OpAmps\\opamp2 3264 1296 R0
SYMATTR InstName U26
SYMATTR Value TL082
SYMBOL cap 3296 1168 R90
WINDOW 0 0 32 VBottom 2
WINDOW 3 32 32 VTop 2
SYMATTR InstName C23
SYMATTR Value 220p
SYMBOL cap 3200 1248 R90
WINDOW 0 0 32 VBottom 2
WINDOW 3 32 32 VTop 2
SYMATTR InstName C24
SYMATTR Value 220p
SYMBOL res 3408 1248 R90
WINDOW 0 0 56 VBottom 2
WINDOW 3 32 56 VTop 2
SYMATTR InstName R62
SYMATTR Value 78k
SYMBOL res 3024 1280 R270
WINDOW 0 32 56 VTop 2
WINDOW 3 0 56 VBottom 2
SYMATTR InstName R60
SYMATTR Value 1k
SYMBOL res 3120 1296 R0
SYMATTR InstName R61
SYMATTR Value 1k
SYMBOL OpAmps\\opamp2 2464 1120 R0
SYMATTR InstName U27
SYMATTR Value TL082
SYMBOL OpAmps\\opamp2 2976 1200 R0
SYMATTR InstName U28
SYMATTR Value TL082
SYMBOL res 2240 112 R90
WINDOW 0 0 56 VBottom 2
WINDOW 3 32 56 VTop 2
SYMATTR InstName R59
SYMATTR Value 300
SYMBOL res 2512 112 R90
WINDOW 0 0 56 VBottom 2
WINDOW 3 32 56 VTop 2
SYMATTR InstName R63
SYMATTR Value 347.31
SYMBOL res 2784 112 R90
WINDOW 0 0 56 VBottom 2
WINDOW 3 32 56 VTop 2
SYMATTR InstName R64
SYMATTR Value 347.31
SYMBOL res 2960 112 R90
WINDOW 0 0 56 VBottom 2
WINDOW 3 32 56 VTop 2
SYMATTR InstName R65
SYMATTR Value 347.31
SYMBOL res 2656 -32 R90
WINDOW 0 0 56 VBottom 2
WINDOW 3 32 56 VTop 2
SYMATTR InstName R66
SYMATTR Value 347.31
SYMBOL cap 2352 112 R90
WINDOW 0 0 32 VBottom 2
WINDOW 3 32 32 VTop 2
SYMATTR InstName C25
SYMATTR Value 4.7n
SYMBOL cap 2624 112 R90
WINDOW 0 0 32 VBottom 2
WINDOW 3 32 32 VTop 2
SYMATTR InstName C26
SYMATTR Value 4.7n
SYMBOL OpAmps\\opamp2 2864 208 R0
SYMATTR InstName U29
SYMATTR Value TL082
SYMBOL OpAmps\\opamp2 2592 208 R0
SYMATTR InstName U30
SYMATTR Value TL082
SYMBOL OpAmps\\opamp2 2320 208 R0
SYMATTR InstName U31
SYMATTR Value TL082
SYMBOL voltage 2096 128 R0
WINDOW 123 24 124 Left 2
WINDOW 39 0 0 Left 0
SYMATTR InstName V11
SYMATTR Value ""
SYMATTR Value2 AC 1
SYMBOL res 2368 32 R90
WINDOW 0 0 56 VBottom 2
WINDOW 3 32 56 VTop 2
SYMATTR InstName R67
SYMATTR Value 2.43k
TEXT -1704 176 Left 2 !.include "C:\\Users\\jimtr\\OneDrive - polymtl\\Projet\\ELE2003_Table15\\LesLTspice\\TL082.lib\\TL082.301"
TEXT -1704 240 Left 2 ;.tran 100u
TEXT 696 -792 Left 2 ;modulateur
TEXT 592 -96 Left 2 ;redresseur
TEXT 1296 184 Left 2 ;Gain
TEXT 688 288 Left 2 ;passe-bas
TEXT -1304 1248 Left 5 ;Démodulateur qui ne fonctionne pas
TEXT -136 1248 Left 5 ;Tests
TEXT 704 -176 Left 2 ;Démodulateur
TEXT 2624 928 Left 2 ;Filtre pour interupteur
TEXT -32 1392 Left 2 ;?
TEXT -48 1768 Left 2 ;Résonateur :
TEXT -1704 264 Left 2 !.ac oct 101 10 150k
TEXT 1776 -856 Left 2 ;Filtre passe-bande
TEXT 72 2016 Left 2 ;Antonio, L = 1.6
TEXT 960 2200 Left 2 ;Multiple feedback
TEXT 1168 2232 Left 2 ;(ordre 2 I guess)
TEXT 2552 984 Left 2 ;Multiple feedback cascade (ordre 6)
TEXT 1864 2208 Left 2 ;Multiple feedback ordre 4 NON
TEXT 2656 968 Left 2 ;Passe-bande étroit
TEXT 3040 912 Left 2 ;ne foncitonne pas en vrai
TEXT 2144 -168 Left 2 ;Filtre passe-bande étrois Tow-thomas

The netlist it stands for:
* MonCircuit.asc
V1 Vcc 0 15
V2 0 Vee 15
X§U1 porteuse N002 Vcc Vee y TL082  ; pins In+ In- V+ V- OUT
R1 y N002 1.5k
R2 Vee N003 6.5k
R3 N003 0 1k
J1 N002 N003 0 J111
V3 porteuse 0 SINE(0 100m 47.5k)
C1 N003 m 1µ
V4 m 0 SINE(0 2 5k)
X§U2 y N011 Vcc Vee N011 TL082  ; pins In+ In- V+ V- OUT
X§U4 N041 N035 Vcc Vee N040 TL082  ; pins In+ In- V+ V- OUT
D2 P001 N038 D
D3 N038 P002 D
R8 N040 0 10k
R9 N041 0 10k
R12 N035 0 10k
R11 P003 N035 10k
D4 N040 P003 D
R6 N035 P001 10k
R7 N041 P002 10k
X§U5 0 P004 Vcc Vee N081 TL082  ; pins In+ In- V+ V- OUT
D5 N079 N081 D
D6 N081 N080 D
R10 N080 N079 2k
R13 N079 P005 4k
R14 P004 NC_01 1k
V5 P005 0 10
X§U6 N080 N078 Vcc Vee N078 TL082  ; pins In+ In- V+ V- OUT
R15 N043 N046 6.8k
X§U7 0 N043 Vcc Vee N044 TL082  ; pins In+ In- V+ V- OUT
D7 N044 N043 D
R16 N042 N043 6.8k
D8 N042 N044 D
R17 N048 N042 3.4k
X§U8 0 N048 Vcc Vee N047 TL082  ; pins In+ In- V+ V- OUT
R18 N047 N048 6.8k
R19 N048 N046 6.8k
X§U9 0 N051 Vcc Vee N063 TL082  ; pins In+ In- V+ V- OUT
X§U10 N067 N053 Vcc Vee N064 TL082  ; pins In+ In- V+ V- OUT
R20 N051 NC_02 10k
R21 N067 N051 10k
R22 N052 N051 10k
R23 N053 N052 10k
R24 N064 N053 10k
D9 N052 N063 D
D10 N063 N067 D
X§U11 N011 N005 Vcc Vee N009 TL082  ; pins In+ In- V+ V- OUT
D11 N009 N010 D
C4 N010 N009 1p
D12 N005 N009 D
X§U12 N010 N006 Vcc Vee y_redresse TL082  ; pins In+ In- V+ V- OUT
R25 N010 0 10k
R26 N006 N005 10k
R27 y_redresse N006 10k
R4 N073 N072 6.48k
R5 N074 N073 3.48k
C2 0 N077 12n
R29 N069 N077 6.98k
C3 N069 N074 910p
X§U3 0 N074 Vcc Vee N075 TL082  ; pins In+ In- V+ V- OUT
R30 N070 N075 12.7k
R31 N076 N070 26.7k
C6 N076 0 750p
X§U13 N076 N071 Vcc Vee N071 TL082  ; pins In+ In- V+ V- OUT
C7 N071 N070 1n
R28 N016 y_redresse 1.11k
R32 N020 N016 3.96k
C5 N020 0 2.4n
C8 N017 N016 24n
X§U14 N020 N017 Vcc Vee N017 TL082  ; pins In+ In- V+ V- OUT
R33 N019 N017 12.8k
R34 N021 N019 26.4k
C9 N021 0 750p
X§U15 N021 m_non-centre Vcc Vee m_non-centre TL082  ; pins In+ In- V+ V- OUT
C10 m_non-centre N019 1n
X§U16 m_non-centre N018 Vcc Vee V_out_demodu TL082  ; pins In+ In- V+ V- OUT
R35 V_out_demodu N018 1k
R36 N018 0 2k
V6 N036 0 SINE(0 1 1k) AC 1
X§U17 N036 N039 Vcc Vee N037 TL082  ; pins In+ In- V+ V- OUT
R37 N037 N039 1k
R38 N039 0 2k
V7 N045 0 AC 1
C11 Vin_A 0 0.1µ
R39 Vin_A N045 580k
X§U18 0 N066 Vcc Vee N057 TL082  ; pins In+ In- V+ V- OUT
C12 N057 N056 470p
C13 N066 N056 470p
R40 N057 N066 89.35k
R41 N065 N056 270
R42 N056 0 270
V8 N065 0 AC 1
X§U19 0 N050 Vcc Vee N049 TL082  ; pins In+ In- V+ V- OUT
X§U20 Vin_A N049 Vcc Vee N050 TL082  ; pins In+ In- V+ V- OUT
R43 N049 Vin_A 5.6k
R44 N050 N049 1k
R45 P006 N050 5.6k
C14 0 P006 0.047µ
R46 0 0 1.089k
X§U21 0 N059 Vcc Vee N055 TL082  ; pins In+ In- V+ V- OUT
C15 N055 N054 470p
C16 N059 N054 470p
R47 N055 N059 89.35k
R48 N058 N054 270
R49 N054 0 270
V9 N058 0 AC 1
X§U22 0 N068 Vcc Vee N062 TL082  ; pins In+ In- V+ V- OUT
C17 N062 N061 470p
C18 N068 N061 470p
R50 N062 N068 89.35k
R51 N060 N061 270
R52 N061 0 270
X§U23 NC_03 N060 Vcc Vee N060 TL082  ; pins In+ In- V+ V- OUT
X§U24 0 N025 Vcc Vee N023 TL082  ; pins In+ In- V+ V- OUT
C19 N023 N022 470p
C20 N025 N022 470p
R53 N023 N025 20.3k
R54 N024 N022 1k
R55 N022 0 1k
V10 N024 0 AC 1
X§U25 0 N030 Vcc Vee N028 TL082  ; pins In+ In- V+ V- OUT
C21 N028 N027 330p
C22 N030 N027 330p
R56 N028 N030 38.5k
R57 N026 N027 1k
R58 N027 0 1k
X§U26 0 N034 Vcc Vee N033 TL082  ; pins In+ In- V+ V- OUT
C23 N033 N032 220p
C24 N034 N032 220p
R62 N033 N034 78k
R60 N031 N032 1k
R61 N032 0 1k
X§U27 N023 N026 Vcc Vee N026 TL082  ; pins In+ In- V+ V- OUT
X§U28 N028 N031 Vcc Vee N031 TL082  ; pins In+ In- V+ V- OUT
R59 N007 N012 300
R63 N013 Vout_PB 347.31
R64 N015 N014 347.31
R65 N008 N015 347.31
R66 N008 N007 347.31
C25 Vout_PB N007 4.7n
C26 N014 N013 4.7n
X§U29 0 N015 Vcc Vee N008 TL082  ; pins In+ In- V+ V- OUT
X§U30 0 N013 Vcc Vee N014 TL082  ; pins In+ In- V+ V- OUT
X§U31 0 N007 Vcc Vee Vout_PB TL082  ; pins In+ In- V+ V- OUT
V11 N012 0 AC 1
R67 Vout_PB N007 2.43k
.model D D
.lib standard.dio
.model NJF NJF
.model PJF PJF
.lib standard.jft
.include "C:\Users\jimtr\OneDrive - polymtl\Projet\ELE2003_Table15\LesLTspice\TL082.lib\TL082.301"
* .tran 100u
* modulateur
* redresseur
* Gain
* passe-bas
* Démodulateur qui ne fonctionne pas
* Tests
* Démodulateur
* Filtre pour interupteur
* ?
* Résonateur :
.ac oct 101 10 150k
* Filtre passe-bande
* Antonio, L = 1.6
* Multiple feedback
* (ordre 2 I guess)
* Multiple feedback cascade (ordre 6)
* Multiple feedback ordre 4 NON
* Passe-bande étroit
* ne foncitonne pas en vrai
* Filtre passe-bande étrois Tow-thomas
.backanno
.end